# Altium schematic sheet STEERING_WHEEL_SWITCHES.SchDoc
size A4; SheetNumber: 1; SheetTotal: 6
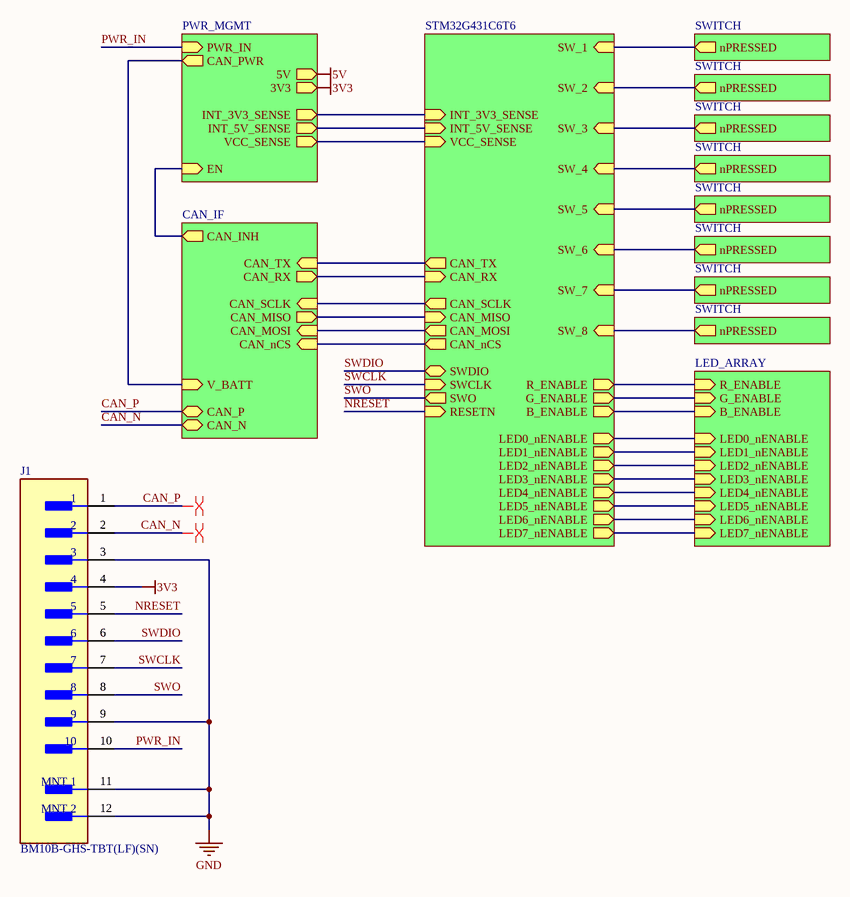
[diagram p0: STEERING_WHEEL_SWITCHES.SchDoc]

## Parts
J1  BM10B-GHS-TBT(LF)(SN)  [FP-BM10B-GHS-TBT_LF_SN-MFG]

## Sub-sheets
CAN_IF = CAN_IF: CAN_TX (in), CAN_RX (out), CAN_SCLK (in), CAN_MISO (out), CAN_MOSI (in), CAN_nCS (in), CAN_INH (out), CAN_P (bidir), CAN_N (bidir), V_BATT (in)
LED_ARRAY = LED_ARRAY: R_ENABLE (in), G_ENABLE (in), B_ENABLE (in), LED0_nENABLE (in), LED1_nENABLE (in), LED2_nENABLE (in), LED3_nENABLE (in), LED4_nENABLE (in), LED5_nENABLE (in), LED6_nENABLE (in), LED7_nENABLE (in)
MCU = STM32G431C6T6: SW_1 (in), SW_2 (in), SW_3 (in), SW_4 (in), SW_5 (in), SW_6 (in), SW_7 (in), SW_8 (in), INT_3V3_SENSE (in), INT_5V_SENSE (in), CAN_TX (out), CAN_RX (in), CAN_SCLK (out), CAN_MISO (in), CAN_MOSI (out), CAN_nCS (out), SWDIO (bidir), SWCLK (in), SWO (out), RESETN (in), R_ENABLE (out), G_ENABLE (out), B_ENABLE (out), LED0_nENABLE (out), LED1_nENABLE (out), LED2_nENABLE (out), LED3_nENABLE (out), LED4_nENABLE (out), LED5_nENABLE (out), LED6_nENABLE (out), LED7_nENABLE (out), VCC_SENSE (in)
PWR_MGMT = PWR_MGMT: PWR_IN (in), EN (in), 5V (out), 3V3 (out), INT_3V3_SENSE (out), INT_5V_SENSE (out), CAN_PWR (out), VCC_SENSE (out)
SWITCH = SWITCH: nPRESSED (out)
SWITCH = SWITCH: nPRESSED (out)
SWITCH = SWITCH: nPRESSED (out)
SWITCH = SWITCH: nPRESSED (out)
SWITCH = SWITCH: nPRESSED (out)
SWITCH = SWITCH: nPRESSED (out)
SWITCH = SWITCH: nPRESSED (out)
SWITCH = SWITCH: nPRESSED (out)

## Nets
3V3: J1.4 ; sheet PWR_MGMT/3V3
5V: sheet PWR_MGMT/5V
GND: J1.3 J1.9 J1.11(MNT_1) J1.12(MNT_2)
CAN_N: J1.2 ; sheet CAN_IF/CAN_N
CAN_P: J1.1 ; sheet CAN_IF/CAN_P
NRESET: J1.5 ; sheet MCU/RESETN
PWR_IN: J1.10 ; sheet PWR_MGMT/PWR_IN
SWCLK: J1.7 ; sheet MCU/SWCLK
SWDIO: J1.6 ; sheet MCU/SWDIO
SWO: J1.8 ; sheet MCU/SWO
(unnamed): sheet PWR_MGMT/EN, sheet CAN_IF/CAN_INH
(unnamed): sheet PWR_MGMT/INT_3V3_SENSE, sheet MCU/INT_3V3_SENSE
(unnamed): sheet PWR_MGMT/INT_5V_SENSE, sheet MCU/INT_5V_SENSE
(unnamed): sheet PWR_MGMT/CAN_PWR, sheet CAN_IF/V_BATT
(unnamed): sheet PWR_MGMT/VCC_SENSE, sheet MCU/VCC_SENSE
(unnamed): sheet MCU/SW_1, sheet SWITCH/nPRESSED
(unnamed): sheet MCU/SW_2, sheet SWITCH/nPRESSED
(unnamed): sheet MCU/SW_3, sheet SWITCH/nPRESSED
(unnamed): sheet MCU/SW_4, sheet SWITCH/nPRESSED
(unnamed): sheet MCU/SW_5, sheet SWITCH/nPRESSED
(unnamed): sheet MCU/SW_6, sheet SWITCH/nPRESSED
(unnamed): sheet MCU/SW_7, sheet SWITCH/nPRESSED
(unnamed): sheet MCU/SW_8, sheet SWITCH/nPRESSED
(unnamed): sheet MCU/CAN_TX, sheet CAN_IF/CAN_TX
(unnamed): sheet MCU/CAN_RX, sheet CAN_IF/CAN_RX
(unnamed): sheet MCU/CAN_SCLK, sheet CAN_IF/CAN_SCLK
(unnamed): sheet MCU/CAN_MISO, sheet CAN_IF/CAN_MISO
(unnamed): sheet MCU/CAN_MOSI, sheet CAN_IF/CAN_MOSI
(unnamed): sheet MCU/CAN_nCS, sheet CAN_IF/CAN_nCS
(unnamed): sheet MCU/R_ENABLE, sheet LED_ARRAY/R_ENABLE
(unnamed): sheet MCU/G_ENABLE, sheet LED_ARRAY/G_ENABLE
(unnamed): sheet MCU/B_ENABLE, sheet LED_ARRAY/B_ENABLE
(unnamed): sheet MCU/LED0_nENABLE, sheet LED_ARRAY/LED0_nENABLE
(unnamed): sheet MCU/LED1_nENABLE, sheet LED_ARRAY/LED1_nENABLE
(unnamed): sheet MCU/LED2_nENABLE, sheet LED_ARRAY/LED2_nENABLE
(unnamed): sheet MCU/LED3_nENABLE, sheet LED_ARRAY/LED3_nENABLE
(unnamed): sheet MCU/LED4_nENABLE, sheet LED_ARRAY/LED4_nENABLE
(unnamed): sheet MCU/LED5_nENABLE, sheet LED_ARRAY/LED5_nENABLE
(unnamed): sheet MCU/LED6_nENABLE, sheet LED_ARRAY/LED6_nENABLE
(unnamed): sheet MCU/LED7_nENABLE, sheet LED_ARRAY/LED7_nENABLE

## Layout directives
differential pair: CAN_N, CAN_P

## Library data of the parts
J1 = CMP-17439-000185-1: Connector Header Surface Mount 10 position 0.049" (1.25mm); Current Rating: 1A; Number of Contacts: 10; Voltage Rating: 50V; Wire/Cable Gauge: 26AWG; Connector Type: Male Pin; Packaging: Tape and Reel; Lead Free: Lead Free; Contact Material: Bronze; Termination: SMD/SMT; Orientation: Straight; Package Quantity: 1; Color: Natural; Housing Material: Nylon; Mount: Surface Mount; Fastening Type: Latch; REACH SVHC: No SVHC; Number of Rows: 1; Series: GH; Voltage Rating (AC): 50V; Number of Positions: 10; Min Operating Temperature: -25°C; Housing Color: Natural; Max Operating Temperature: 85°C; Contact Plating: Tin; Pitch: 1.25mm